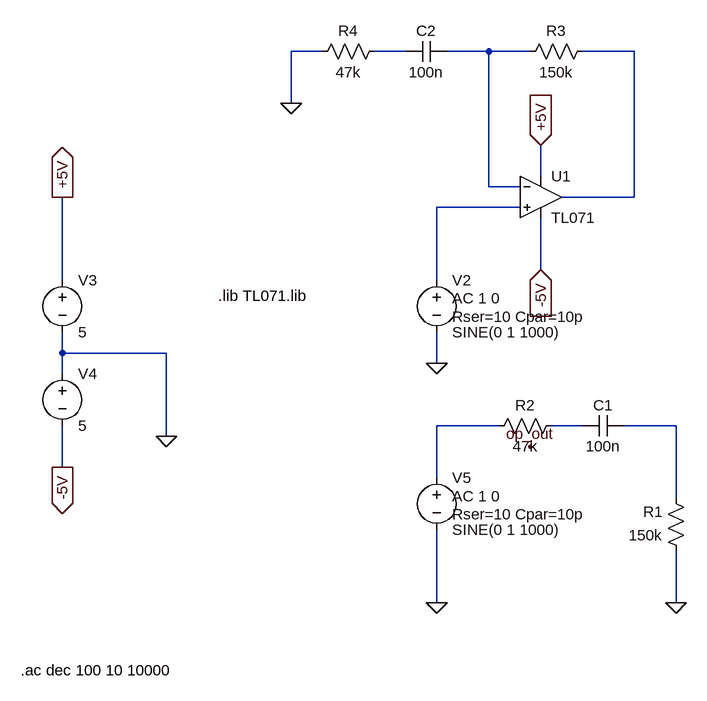
[diagram p0: schematic ActiveFilter.asc]
ActiveFilter.asc, the LTspice schematic file:
Version 4.1
SHEET 1 880 680
WIRE -320 -608 -368 -608
WIRE -192 -608 -240 -608
WIRE -64 -608 -128 -608
WIRE 0 -608 -64 -608
WIRE 160 -608 80 -608
WIRE -368 -528 -368 -608
WIRE 16 -416 16 -464
WIRE -64 -400 -64 -608
WIRE -16 -400 -64 -400
WIRE 160 -384 160 -608
WIRE 160 -384 48 -384
WIRE -16 -368 -144 -368
WIRE 16 -272 16 -352
WIRE -720 -256 -720 -384
WIRE -144 -256 -144 -368
WIRE -720 -144 -720 -176
WIRE -560 -144 -720 -144
WIRE -144 -128 -144 -176
WIRE -720 -112 -720 -144
WIRE -48 -32 -144 -32
WIRE 80 -32 32 -32
WIRE 224 -32 144 -32
WIRE -560 -16 -560 -144
WIRE -720 32 -720 -32
WIRE -144 48 -144 -32
WIRE 224 80 224 -32
WIRE -144 240 -144 128
WIRE 224 240 224 160
FLAG 224 240 0
FLAG -144 240 0
FLAG -144 -128 0
FLAG -560 -16 0
FLAG -720 -384 +5V
IOPIN -720 -384 Out
FLAG -720 32 -5V
IOPIN -720 32 Out
FLAG 16 -464 +5V
IOPIN 16 -464 In
FLAG 16 -272 -5V
IOPIN 16 -272 In
FLAG -368 -528 0
FLAG 0 0 op_out
SYMBOL res 240 176 R180
WINDOW 0 36 76 Left 2
WINDOW 3 36 40 Left 2
SYMATTR InstName R1
SYMATTR Value 150k
SYMBOL res -64 -16 R270
WINDOW 0 32 56 VTop 2
WINDOW 3 0 56 VBottom 2
SYMATTR InstName R2
SYMATTR Value 47k
SYMBOL cap 144 -48 R90
WINDOW 0 0 32 VBottom 2
WINDOW 3 32 32 VTop 2
SYMATTR InstName C1
SYMATTR Value 100n
SYMBOL voltage -144 -272 R0
WINDOW 123 24 44 Left 2
WINDOW 39 24 72 Left 2
SYMATTR InstName V2
SYMATTR Value SINE(0 1 1000)
SYMATTR Value2 AC 1 0
SYMATTR SpiceLine Rser=10 Cpar=10p
SYMBOL OpAmps\\opamp2 16 -448 R0
SYMATTR InstName U1
SYMATTR Value TL071
SYMATTR SpiceModel TL071
SYMBOL voltage -720 -272 R0
WINDOW 123 0 0 Left 0
WINDOW 39 0 0 Left 0
SYMATTR InstName V3
SYMATTR Value 5
SYMBOL voltage -720 -128 R0
WINDOW 123 0 0 Left 0
WINDOW 39 0 0 Left 0
SYMATTR InstName V4
SYMATTR Value 5
SYMBOL res 96 -624 R90
WINDOW 0 0 56 VBottom 2
WINDOW 3 32 56 VTop 2
SYMATTR InstName R3
SYMATTR Value 150k
SYMBOL res -224 -624 R90
WINDOW 0 0 56 VBottom 2
WINDOW 3 32 56 VTop 2
SYMATTR InstName R4
SYMATTR Value 47k
SYMBOL cap -128 -624 R90
WINDOW 0 0 32 VBottom 2
WINDOW 3 32 32 VTop 2
SYMATTR InstName C2
SYMATTR Value 100n
SYMBOL voltage -144 32 R0
WINDOW 123 24 44 Left 2
WINDOW 39 24 72 Left 2
SYMATTR InstName V5
SYMATTR Value SINE(0 1 1000)
SYMATTR Value2 AC 1 0
SYMATTR SpiceLine Rser=10 Cpar=10p
TEXT -480 -232 Left 2 !.lib TL071.lib
TEXT -784 344 Left 2 !.ac dec 100 10 10000

The netlist it stands for:
* ActiveFilter.asc
R1 0 N007 150k
R2 N005 N006 47k
C1 N007 N006 100n
V2 N004 0 SINE(0 1 1000) AC 1 0 Rser=10 Cpar=10p
X§U1 N004 N002 +5V -5V N003 TL071 TL071  ; pins In+ In- V+ V- OUT
V3 +5V 0 5
V4 0 -5V 5
R3 N003 N002 150k
R4 N001 0 47k
C2 N002 N001 100n
V5 N005 0 SINE(0 1 1000) AC 1 0 Rser=10 Cpar=10p
.lib TL071.lib
.ac dec 100 10 10000
.backanno
.end